# Altium project DDC112_Prototypes.PrjPcb
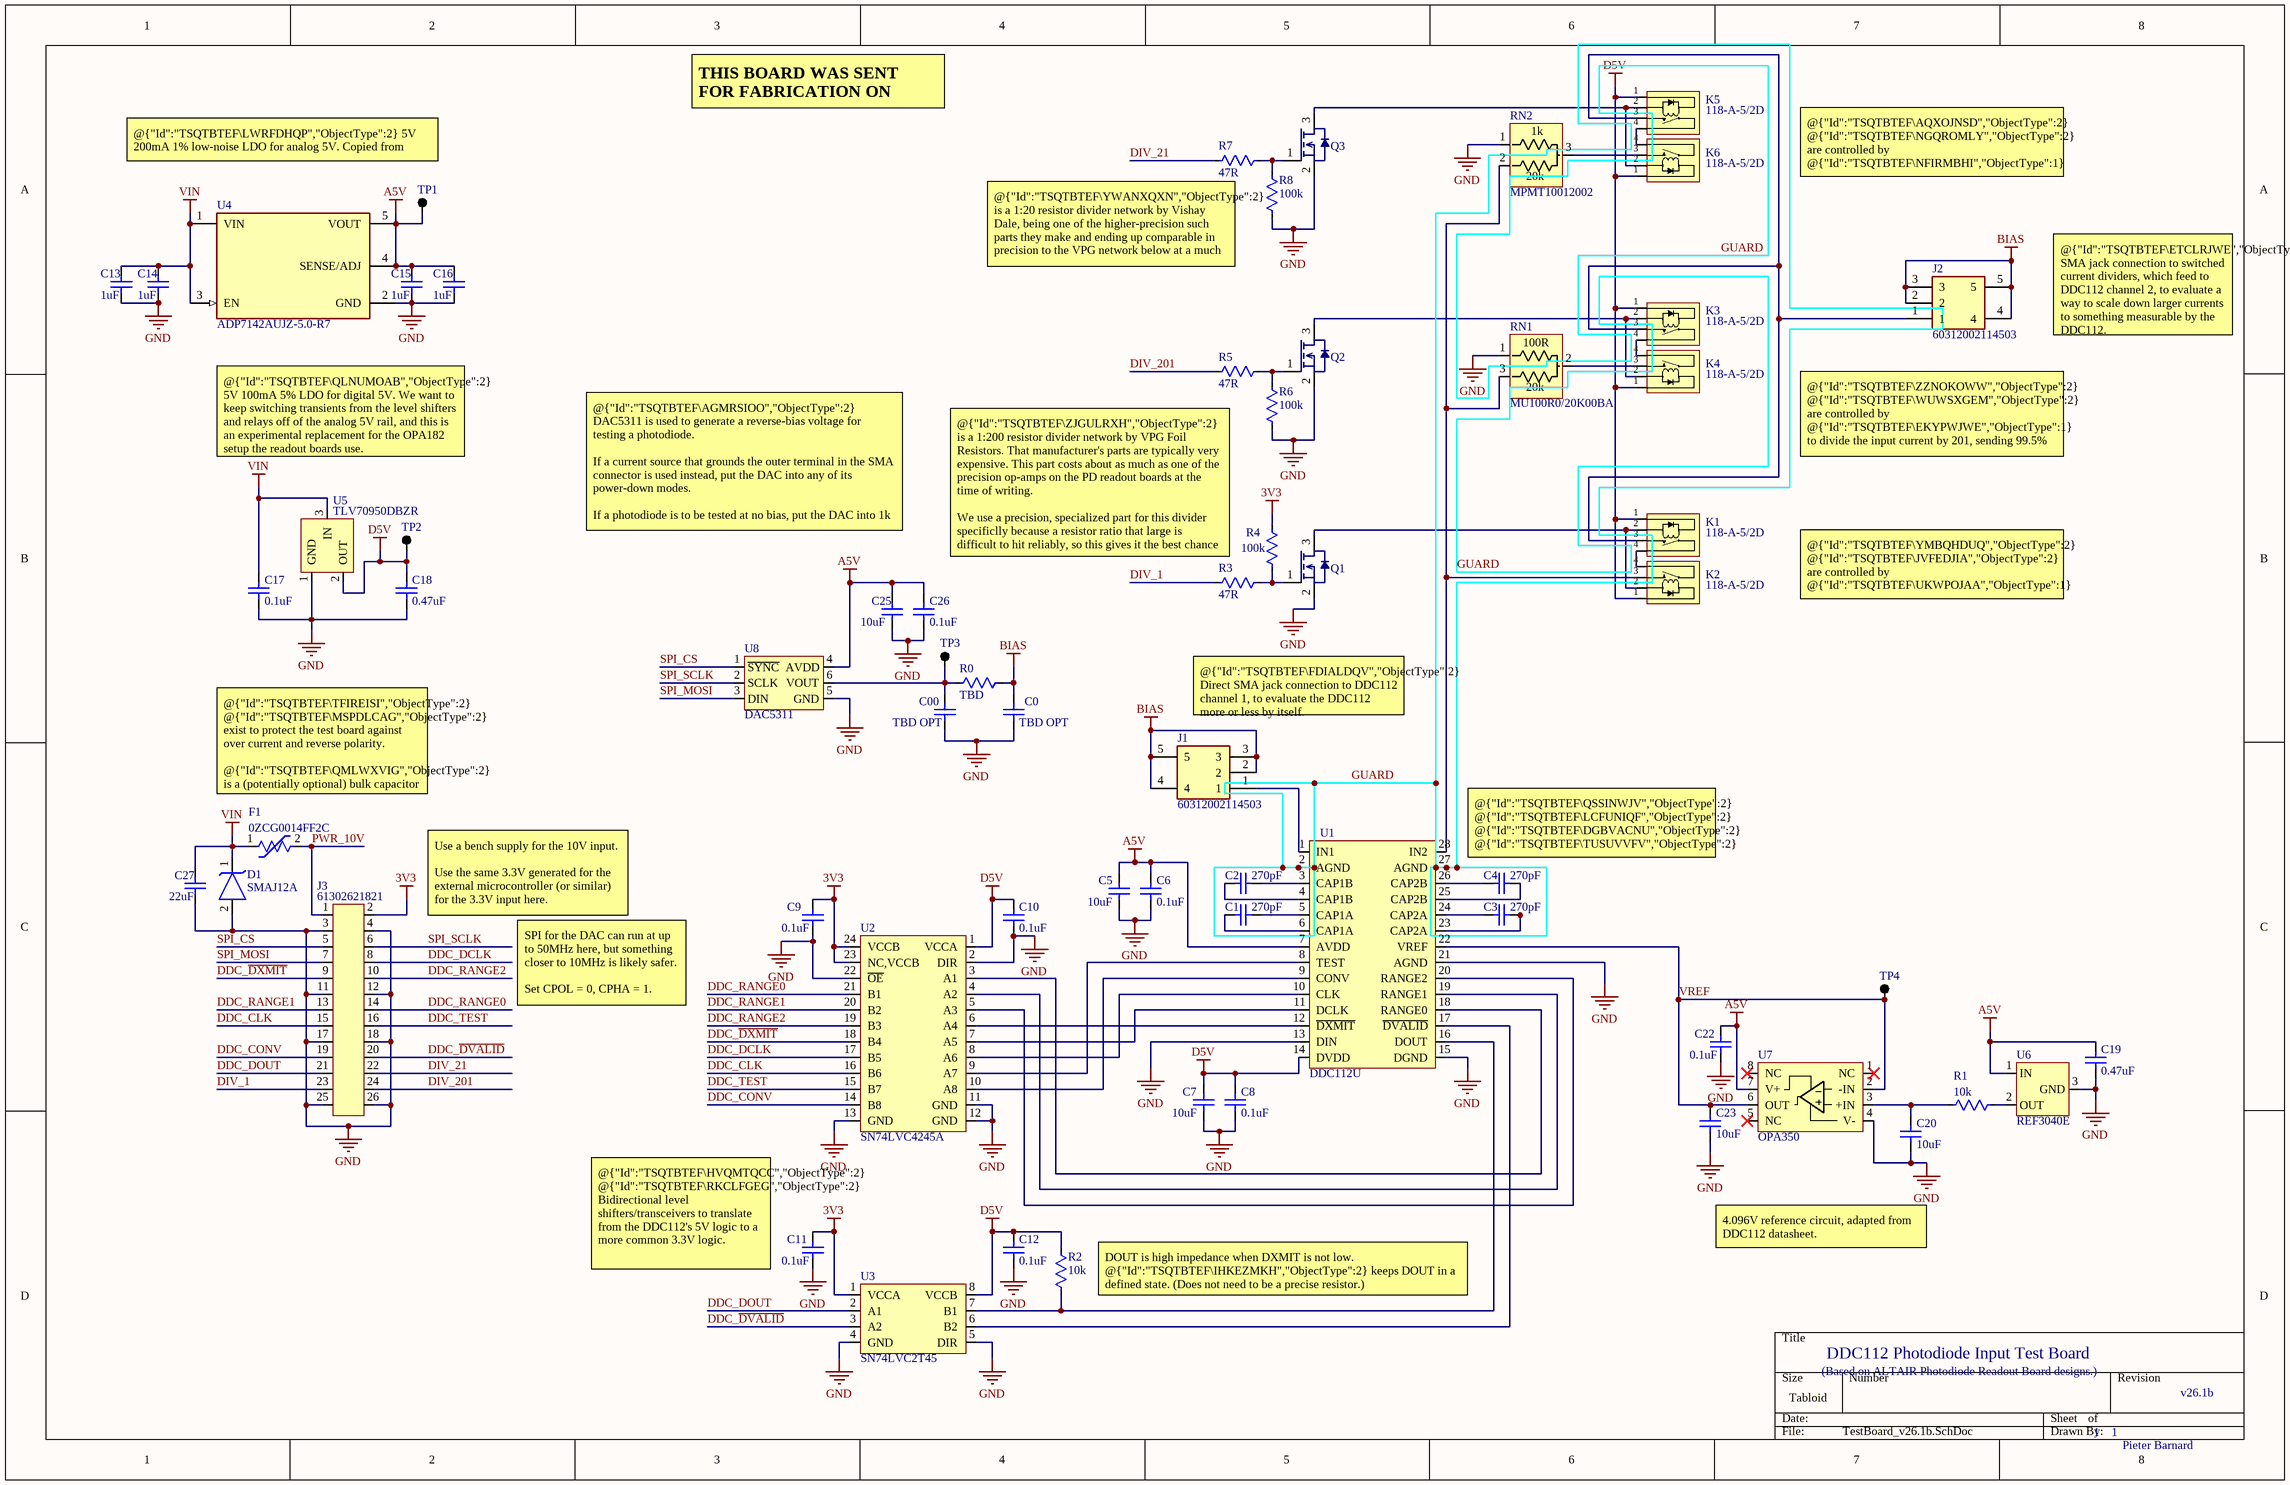
[diagram p0: TestBoard_v26.1b.SchDoc]
1 sheet, 64 parts. Net scope: global (net labels, ports and power ports of the same name join across sheets).
Board file: DDC112_TestBoard_v26.1b.PcbDoc

## Sheet TestBoard_v26.1b.SchDoc
size Tabloid; SheetNumber: 1; SheetTotal: 1

### Parts
C00  TBD OPT  [CAP 0603 IPC MID DENSITY]
C0  TBD OPT  [CAP 0603 IPC MID DENSITY]
C1  270pF  [CAP 1206 NON-IPC CUSTOM]
C2  270pF  [CAP 1206 NON-IPC CUSTOM]
C3  270pF  [CAP 1206 NON-IPC CUSTOM]
C4  270pF  [CAP 1206 NON-IPC CUSTOM]
C5  10uF  [CAP 0805 IPC MID DENSITY]
C6  0.1uF  [CAP 0603 IPC MID DENSITY]
C7  10uF  [CAP 0805 IPC MID DENSITY]
C8  0.1uF  [CAP 0603 IPC MID DENSITY]
C9  0.1uF  [CAP 0603 IPC MID DENSITY]
C10  0.1uF  [CAP 0603 IPC MID DENSITY]
C11  0.1uF  [CAP 0603 IPC MID DENSITY]
C12  0.1uF  [CAP 0603 IPC MID DENSITY]
C13  1uF  [CAP 0805 IPC MID DENSITY]
C14  1uF  [CAP 0805 IPC MID DENSITY]
C15  1uF  [CAP 0805 IPC MID DENSITY]
C16  1uF  [CAP 0805 IPC MID DENSITY]
C17  0.1uF  [CAP 0603 IPC MID DENSITY]
C18  0.47uF  [CAP 0603 IPC MID DENSITY]
C19  0.47uF  [CAP 0603 IPC MID DENSITY]
C20  10uF  [CAP 0805 IPC MID DENSITY]
C22  0.1uF  [CAP 0603 IPC MID DENSITY]
C23  10uF  [CAP 0805 IPC MID DENSITY]
C25  10uF  [CAP 0805 IPC MID DENSITY]
C26  0.1uF  [CAP 0603 IPC MID DENSITY]
C27  22uF  [CAP 1210 NON-IPC MURATA]
D1  SMAJ12A  [DO-214AC SMA VISHAY]
F1  0ZCG0014FF2C  [POLYFUSE 1812 NON-IPC BELFUSE]
J1  60312002114503  [COAX SMA THT]
J2  60312002114503  [COAX SMA THT]
J3  61302621821  [61302621821]
K1  118-A-5/2D  [118-A-5/2D]
K2  118-A-5/2D  [118-A-5/2D]
K3  118-A-5/2D  [118-A-5/2D]
K4  118-A-5/2D  [118-A-5/2D]
K5  118-A-5/2D  [118-A-5/2D]
K6  118-A-5/2D  [118-A-5/2D]
Q1  DMG2302UK  [SOT90-3 LOW DENSITY]  (value not drawn)
Q2  DMG2302UK  [SOT90-3 LOW DENSITY]  (value not drawn)
Q3  DMG2302UK  [SOT90-3 LOW DENSITY]  (value not drawn)
R0  TBD  [RES 0603 IPC MID DENSITY]
R1  10k  [RES 0603 IPC MID DENSITY]
R2  10k  [RES 0603 IPC MID DENSITY]
R3  47R  [RES 0603 IPC MID DENSITY]
R4  100k  [RES 0603 IPC MID DENSITY]
R5  47R  [RES 0603 IPC MID DENSITY]
R6  100k  [RES 0603 IPC MID DENSITY]
R7  47R  [RES 0603 IPC MID DENSITY]
R8  100k  [RES 0603 IPC MID DENSITY]
RN1  MU100R0/20K00BA  [RES NETWORK MOLDED J-LEAD VPG]
RN2  MPMT10012002  [SOT23-3 MID DENSITY VISHAY]
TP1  Testpoint  [TESTPOINT THT]  (value not drawn)  (no BOM)
TP2  Testpoint  [TESTPOINT THT]  (value not drawn)  (no BOM)
TP3  Testpoint  [TESTPOINT THT]  (value not drawn)  (no BOM)
TP4  Testpoint  [TESTPOINT THT]  (value not drawn)  (no BOM)
U1  DDC112U  [28SOIC LOW DENSITY TI]
U2  SN74LVC4245A  [24TSSOP LOW DENSITY TI]
U3  SN74LVC2T45  [8VSSOP LOW DENSITY TI]
U4  ADP7142AUJZ-5.0-R7  [SOT23-5 HIGH DENSITY AD]
U5  TLV70950DBZR  [SOT23-3 MID DENSITY TI]
U6  REF3040E  [SOT23-3 MID DENSITY TI]
U7  OPA350  [8VSSOP LOW DENSITY TI]
U8  DAC5311  [SOT363-6 MID DENSITY TI]

### Nets
3V3: C9.1 C11.1 J3.2 R4.2 U2.23(NC,VCCB) U2.24(VCCB) U3.1(VCCA)
A5V: C5.1 C6.1 C15.1 C16.1 C19.1 C22.2 C25.1 C26.1 TP1.1 U1.7(AVDD) U4.4(SENSE/ADJ) U4.5(VOUT) U6.1(IN) U7.7(V+) U8.4(AVDD)
BIAS: C0.1 J1.2 J1.3 J1.4 J1.5 J2.2 J2.3 J2.4 J2.5 R0.1
D5V: C7.1 C8.1 C10.1 C12.1 C18.1 K1.1 K2.1 K3.1 K4.1 K5.1 K6.1 R2.2 TP2.1 U1.14(DVDD) U2.1(VCCA) U3.8(VCCB) U5.2(OUT)
GND: C00.2 C0.2 C5.2 C6.2 C7.2 C8.2 C9.2 C10.2 C11.2 C12.2 C13.2 C14.2 C15.2 C16.2 C17.2 C18.2 C19.2 C20.2 C22.1 C23.2 C25.2 C26.2 C27.2 D1.2(Anode) J3.3 J3.4 J3.11 J3.12 J3.17 J3.18 J3.25 J3.26 Q1.2(Source) Q2.2(Source) Q3.2(Source) R6.1 R8.1 RN1.1 RN2.1 U1.13(DIN) U1.15(DGND) U1.21(AGND) U2.2(DIR) U2.11(GND) U2.12(GND) U2.13(GND) U2.22(~{OE}) U3.4(GND) U3.5(DIR) U4.2(GND) U5.1(GND) U6.3(GND) U7.4(V-) U8.5(GND)
VIN: C13.1 C14.1 C17.1 C27.1 D1.1(Cathode) F1.1 U4.1(VIN) U4.3(EN) U5.3(IN)
DDC_CLK: J3.15 U2.16(B6)
DDC_CONV: J3.19 U2.14(B8)
DDC_~{DVALID}: J3.20 U3.3(A2)
DDC_~{DXMIT}: J3.9 U2.18(B4)
DDC_DCLK: J3.8 U2.17(B5)
DDC_DOUT: J3.21 U3.2(A1)
DDC_RANGE0: J3.14 U2.21(B1)
DDC_RANGE1: J3.13 U2.20(B2)
DDC_RANGE2: J3.10 U2.19(B3)
DDC_TEST: J3.16 U2.15(B7)
DIV_1: J3.23 R3.2
DIV_21: J3.22 R7.2
DIV_201: J3.24 R5.2
GUARD: U1.2(AGND) U1.27(AGND)
PWR_10V: F1.2 J3.1
SPI_CS: J3.5 U8.1(~{SYNC})
SPI_MOSI: J3.7 U8.3(DIN)
SPI_SCLK: J3.6 U8.2(SCLK)
VREF: C23.1 TP4.1 U1.22(VREF) U7.2(-IN) U7.6(OUT)
NetC00_1: C00.1 R0.2 TP3.1 U8.6(VOUT)
NetC1_1: C1.1 U1.5(CAP1A)
NetC1_2: C1.2 U1.6(CAP1A)
NetC2_1: C2.1 U1.4(CAP1B)
NetC2_2: C2.2 U1.3(CAP1B)
NetC3_1: C3.1 U1.24(CAP2A)
NetC3_2: C3.2 U1.23(CAP2A)
NetC4_1: C4.1 U1.25(CAP2B)
NetC4_2: C4.2 U1.26(CAP2B)
NetC20_1: C20.1 R1.1 U7.3(+IN)
NetJ1_1: J1.1 U1.1(IN1)
NetJ2_1: J2.1 K1.3 K3.3 K5.3
NetK1_2: K1.2 K2.2 Q1.3(Drain)
NetK1_4: K1.4 K2.4
NetK2_3: K2.3 RN1.3 RN2.2 U1.28(IN2)
NetK3_2: K3.2 K4.2 Q2.3(Drain)
NetK3_4: K3.4 K4.4
NetK4_3: K4.3 RN1.2
NetK5_2: K5.2 K6.2 Q3.3(Drain)
NetK5_4: K5.4 K6.4
NetK6_3: K6.3 RN2.3
NetQ1_1: Q1.1(Gate) R3.1 R4.1
NetQ2_1: Q2.1(Gate) R5.1 R6.2
NetQ3_1: Q3.1(Gate) R7.1 R8.2
NetR1_2: R1.2 U6.2(OUT)
NetR2_1: R2.1 U1.16(DOUT) U3.7(B1)
NetU1_8: U1.8(TEST) U2.9(A7)
NetU1_9: U1.9(CONV) U2.10(A8)
NetU1_10: U1.10(CLK) U2.8(A6)
NetU1_11: U1.11(DCLK) U2.7(A5)
NetU1_12: U1.12(~{DXMIT}) U2.6(A4)
NetU1_17: U1.17(~{DVALID}) U3.6(B2)
NetU1_18: U1.18(RANGE0) U2.3(A1)
NetU1_19: U1.19(RANGE1) U2.4(A2)
NetU1_20: U1.20(RANGE2) U2.5(A3)

Not connected (* = marked no-connect by the designer): U7 1(NC)* 5(NC)* 8(NC)*

### Notes on the sheet
- @{"Id":"TSQTBTEF\LWRFDHQP","ObjectType":2} 5V 200mA 1% low-noise LDO for analog 5V. Copied from readout board design for the ADS124S08 AVDD.
- THIS BOARD WAS SENT FOR FABRICATION ON 2026-04-28.
- @{"Id":"TSQTBTEF\AQXOJNSD","ObjectType":2} @{"Id":"TSQTBTEF\NGQROMLY","ObjectType":2} are controlled by @{"Id":"TSQTBTEF\NFIRMBHI","ObjectType":1} to divide the input current by 21, sending 95.2% of the current to GND instead. Should be able to measure currents up to 147uA, best-case 70pA error.
- (near R7) @{"Id":"TSQTBTEF\YWANXQXN","ObjectType":2} is a 1:20 resistor divider network by Vishay Dale, being one of the higher-precision such parts they make and ending up comparable in precision to the VPG network below at a much lower cost.
- @{"Id":"TSQTBTEF\ETCLRJWE","ObjectType":2} SMA jack connection to switched current dividers, which feed to DDC112 channel 2, to evaluate a way to scale down larger currents to something measurable by the DDC112.
- @{"Id":"TSQTBTEF\QLNUMOAB","ObjectType":2} 5V 100mA 5% LDO for digital 5V. We want to keep switching transients from the level shifters and relays off of the analog 5V rail, and this is an experimental replacement for the OPA182 setup the readout boards use.
- (near J2) @{"Id":"TSQTBTEF\ZZNOKOWW","ObjectType":2} @{"Id":"TSQTBTEF\WUWSXGEM","ObjectType":2} are controlled by @{"Id":"TSQTBTEF\EKYPWJWE","ObjectType":1} to divide the input current by 201, sending 99.5% of the current to GND instead. Should be able to measure currents up to 1.407mA, best-case 670pA error.
- @{"Id":"TSQTBTEF\AGMRSIOO","ObjectType":2} DAC5311 is used to generate a reverse-bias voltage for testing a photodiode.
  If a current source that grounds the outer terminal in the SMA connector is used instead, put the DAC into any of its power-down modes.
  If a photodiode is to be tested at no bias, put the DAC into 1k or 100k power-down modes. (Not High-Z.)
- @{"Id":"TSQTBTEF\ZJGULRXH","ObjectType":2} is a 1:200 resistor divider network by VPG Foil Resistors. That manufacturer's parts are typically very expensive. This part costs about as much as one of the precision op-amps on the PD readout boards at the time of writing.
  We use a precision, specialized part for this divider specificlly because a resistor ratio that large is difficult to hit reliably, so this gives it the best chance of working.
- @{"Id":"TSQTBTEF\YMBQHDUQ","ObjectType":2} @{"Id":"TSQTBTEF\JVFEDJIA","ObjectType":2} are controlled by @{"Id":"TSQTBTEF\UKWPOJAA","ObjectType":1} to bypass the dividers and send all current to the DDC112 with minimal resistance. Should be able to measure current up to 7uA, best-case 3pA error.
- (near J1) @{"Id":"TSQTBTEF\FDIALDQV","ObjectType":2} Direct SMA jack connection to DDC112 channel 1, to evaluate the DDC112 more or less by itself.
- @{"Id":"TSQTBTEF\TFIREISI","ObjectType":2} @{"Id":"TSQTBTEF\MSPDLCAG","ObjectType":2} exist to protect the test board against over current and reverse polarity.
  @{"Id":"TSQTBTEF\QMLWXVIG","ObjectType":2} is a (potentially optional) bulk capacitor for the 10V power supply.
- @{"Id":"TSQTBTEF\QSSINWJV","ObjectType":2} @{"Id":"TSQTBTEF\LCFUNIQF","ObjectType":2} @{"Id":"TSQTBTEF\DGBVACNU","ObjectType":2} @{"Id":"TSQTBTEF\TUSUVVFV","ObjectType":2} are through-hole C0G/NP0 to match TI's DDC112 evaluation board. The hope is that they are less sensitive to strain from board flex and solder joints this way.
- Use a bench supply for the 10V input.
  Use the same 3.3V generated for the external microcontroller (or similar) for the 3.3V input here.
- SPI for the DAC can run at up to 50MHz here, but something closer to 10MHz is likely safer.
  Set CPOL = 0, CPHA = 1.
- (near C11) @{"Id":"TSQTBTEF\HVQMTQCC","ObjectType":2} @{"Id":"TSQTBTEF\RKCLFGEG","ObjectType":2} Bidirectional level shifters/transceivers to translate from the DDC112's 5V logic to a more common 3.3V logic.
  Parts chosen based on DDC112EVM by TI.
- (near R2) DOUT is high impedance when DXMIT is not low. @{"Id":"TSQTBTEF\IHKEZMKH","ObjectType":2} keeps DOUT in a defined state. (Does not need to be a precise resistor.)
- 4.096V reference circuit, adapted from DDC112 datasheet.
- DDC112 Photodiode Input Test Board
- (Based on ALTAIR Photodiode Readout Board designs.)
- 1
- v26.1b
- Pieter Barnard
- (in symbol MPMT10012002) 1k; 20k
- (in symbol MU100R0/20K00BA) 100R; 20k

### Library data of the parts
C00 C0 C6 C8-C12 C17 C22 C26 = CAP: Kemet C0603C104K5RACAUTO - Cap Ceramic 0.1uF 50V X7R 10% 0603 125C Paper T/R; MF: KEMET; MP: C0603C104K5RACAUTO
C1-C4 = CAP: Yageo CC1206FRNPO9BN271 - Cap Ceramic 270pF 1% C0G/NP0 50V SMD 1206; MF: YAGEO; MP: CC1206FRNPO9BN271
C5 C7 C20 C23 C25 = CAP: Murata GRM21BR61E106KA73L - Cap Ceramic 10uF 10% 25V X5R 0805; MF: Murata; MP: GRM21BR61E106KA73L
C13-C16 = CAP: Kemet C0805C105K3RACTU - Cap ceramic 1uF 10% X7R SMD 0805; MF: KEMET; MP: C0805C105K3RACTU
C18 C19 = CAP: Murata GRM188R71E474KA12D - Cap Ceramic 0.47uF 25V X7R 10% 0603 125C; MF: Murata; MP: GRM188R71E474KA12D
C27 = CAP: Murata GRM32ER71E226ME15K - Cap Ceramic 22uF 10% 25V X7R 1210; MF: Murata; MP: GRM32ER71E226ME15K
D1 = Zener: Vishay SMAJ12A-M3/61 - TVS Diode 12V Standoff 13.3V Breakdown DO-214AC; MF: Vishay General Semiconductor; MP: SMAJ12A-M3/61
F1 = Polyfuse: Bel Fuse 0ZCG0014FF2C - Polymeric PTC Resettable Fuse 30V 140mA hold 300mA trip SMD 1812; MF: Bel Fuse Inc.; MP: 0ZCG0014FF2C
J1 J2 = 60312002114503: Coaxial, SMA Female Jack, 50 Ohm, Through-Hole; MF: Wurth Elektronik; Datasheet Link: https://katalog.we-online.de/em/datasheet/60312002114503.pdf; Height: 9.56mm; MP: 60312002114503; Mouser Part Number: 710-60312002114503; Mouser Price/Stock: https://www.mouser.co.uk/ProductDetail/Wurth-Elektronik/60312002114503?qs=3jNSNtuqJTL%2FGpZA1FAOxw%3D%3D
J3 = 61302621821: Wurth Elektronik dual socket header 26 pos 0.1in pitch THT; MF: Wurth Elektronik; MP: 61302621821
K1-K6 = RELAY 118-A-5/2D: High coil resistance SIL/SIP Reed Relay 118-A-5/2D; MF: Pickering; MP: 118-1-A-5/2D
Q1-Q3 = NMOS DMG2302UK: DIODES INC. Power MOSFET, N Channel, 20 V, 2.8 A, 0.061 ohm, SOT-23, Surface Mount; MP: DMG2302UK-7; ComponentLink1URL: http://www.farnell.com/datasheets/2814387.pdf?src-supplier=Farnell; ComponentLink1Description: http://www.farnell.com/datasheets/2814387.pdf?src-supplier=Farnell; ComponentLink2URL: http://www.farnell.com/datasheets/2814387.pdf?src-supplier=Element14; ComponentLink2Description: http://www.farnell.com/datasheets/2814387.pdf?src-supplier=Element14; ComponentLink3URL: https://www.diodes.com/assets/Datasheets/DMG2302UK.pdf?src-supplier=Digi-Key; ComponentLink3Description: https://www.diodes.com/assets/Datasheets/DMG2302UK.pdf?src-supplier=Digi-Key; ComponentLink4URL: http://www.farnell.com/datasheets/2814387.pdf?src-supplier=Newark; ComponentLink4Description: http://www.farnell.com/datasheets/2814387.pdf?src-supplier=Newark; MF: Diodes
R0 = RES: Vishay CRCW06030000Z0EA - Res 0 Ohms 1/8W SMD 0603; MF: Vishay Dale; MP: CRCW06030000Z0EA
R1 R2 = RES: Res, Any, Manually select footprint; MF: Panasonic Industry; MP: ERJ-3AEB103V
R3 R5 R7 = RES: Vishay CRCW060347R0JNEA - Res 47Ohm 5% 1/8W SMD 0603; MF: Vishay Dale; MP: CRCW060347R0JNEA
R4 R6 R8 = RES: Panasonic ERJ-3GEYJ104V - Res100k 5% 1/10W SMD 0603; MF: Panasonic Industry; MP: ERJ-3GEYJ104V
RN1 = MU100R0/20K00BA: VPG MU100R0/20K00BA - Res Divider 100R 20kR, absolute 0.1% 5ppm/C. ratop 0.05% 5ppm/C, 1210 J-lead; MF: VPG Foil Resistors; MP: MU100R0/20K00BA
RN2 = MPMT10012002: Vishay MPMT10012002 - Res Divider 1kR 20kR, absolute 0.1% 25ppm/C. ratio 0.05% 2ppm/C, SOT23-3; MF: Vishay Dale; MP: MPMT10012002AT1
U1 = DDC112U: Dual Current Input 20-Bit ADC 28SOIC; MF: Texas Instruments; MP: DDC112U
U2 = SN74LVC4245A: Octal Bus Transceiver and 3.3V to 5V Shifter with Tri-State Outputs 24TSSOP; MF: Texas Instruments; MP: SN74LVC4245APWR
U3 = SN74LVC2T45: Dual-Bit Dual-Supply Bus Transceiver With Configurable Voltage Translation 8VSSOP; MF: Texas Instruments; MP: SN74LVC2T45DCUR
U4 = ADP7142AUJZ-R7: 5-40V 200mA Low Noise CMOS LDO Adjustable Linear Regulator TSOT23; Manufacturer: Analog Devices; Nominal Supply Current: 50-180uA; Output Type: AdjustableProgrammable; Max Supply Voltage: 40V; Number Of Outputs: 1; Dropout Voltage: 200mV; Output Voltage: 1.2-5V; Min Supply Voltage: 2.7V; Max Junction Temp: +150°C; Accuracy Percentage: 0.8%; Ambient Temperature Range Low: -40°C; ComponentLink2Description: Datasheet; Digikey Description: IC REG LIN POS ADJ 200MA TSOT23; Device Class L1: Integrated Circuits (ICs); Mouser Description: LDO Regulator Pos 1.5V to 5V 0.2A 5-Pin TSOT-23 T/R; Height: 1mm; Temperature Range Low: -40°C; Output Current: 200mA; Device Class L3: Voltage Regulators - Linear; Octopart: https://octopart.com/adp7142aujz-r7-analog+devices-38928114; Category: IC; Manufacturer Part Number: ADP7142AUJZ-R7; ComponentLink2URL: https://www.analog.com/media/en/technical-documentation/data-sheets/ADP7142.pdf; Device Class L2: Power Management ICs; Package: UJ-5; Automotive: No; Lead Free: Yes; Ambient Temperature Range High: +125°C; Temperature: -40°C to +125°C; Temperature Range High: +125°C; RoHS: TRUE; MF: Analog Devices; MP: ADP7142AUJZ-5.0-R7
U5 = TLV70950DBZR: 5V 150mA output, 30V input Fixed Output Linear-Voltage Regulator, SOT23-3; MF: Texas Instruments; MP: TLV70950DBZR
U6 = REF3040EAIDBZR: Low-Drift Low-Power Series Voltage Reference 4.096V SOT23-3; MF: Texas Instruments; MP: REF3040EAIDBZR
U7 = OPA350EA: High-Speed Single-Supply Rail-to-Rail Op Amp, MicroAmplifier Series, 8VSSOP; MF: Texas Instruments; MP: OPA350EA/2K5
U8 = DAC5311: DAC 8bit 1 channel SPI Supply Reference Buffered Voltage; MF: Texas Instruments; MP: DAC5311IDCKR